# EAGLE schematic OpenEVSE_PLUS_v1 (EAGLE 6.0)
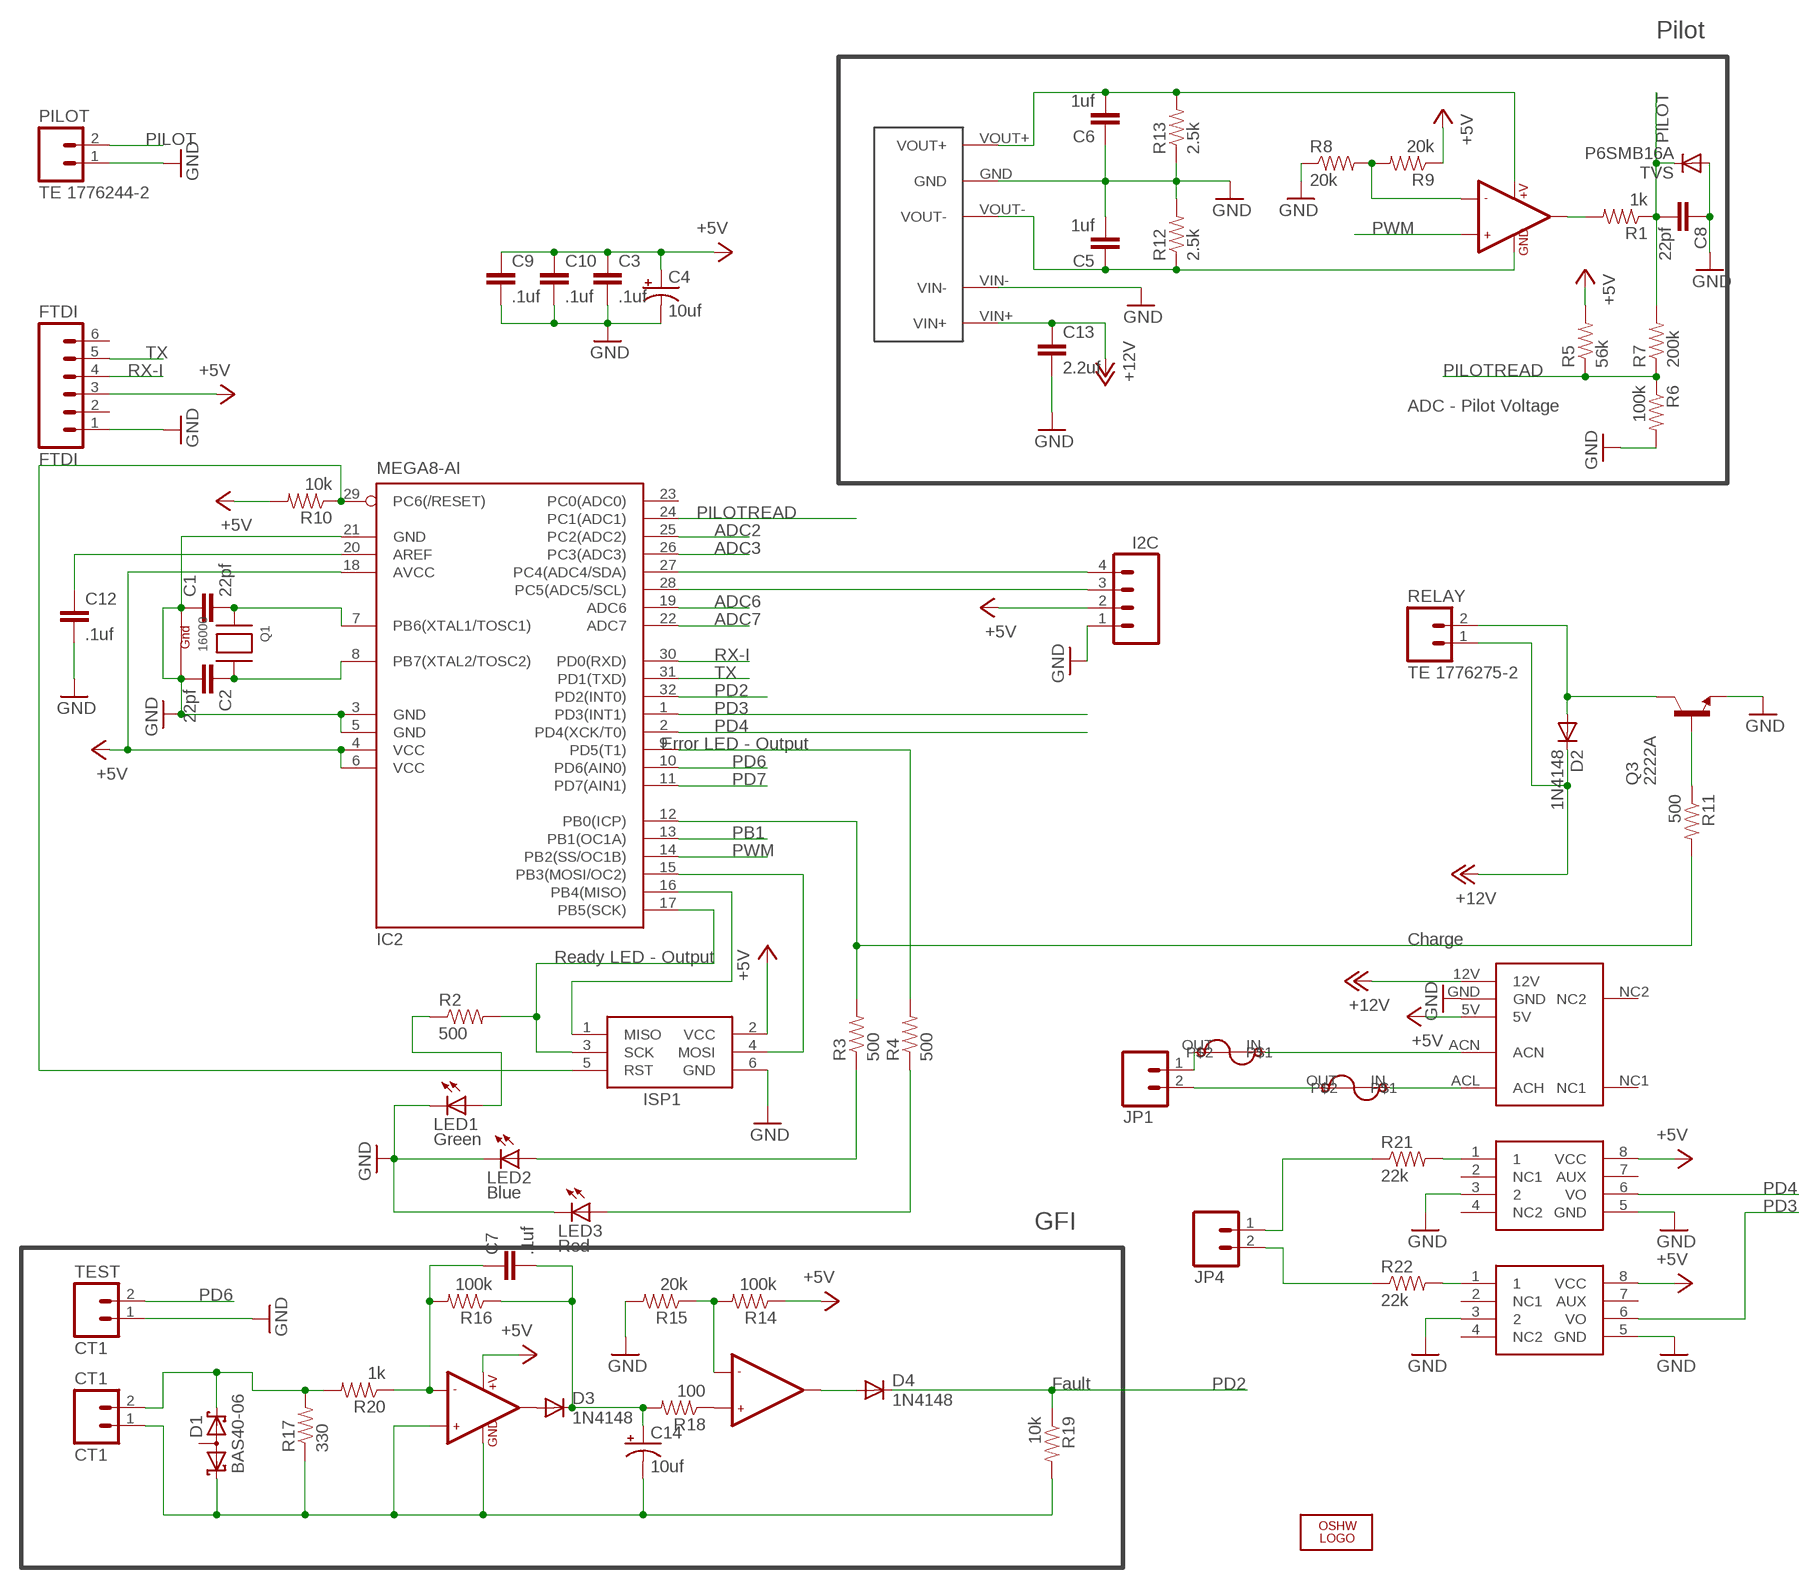
[diagram p0: schematic, sheet 1]

## Parts
C1  22pf  CAP0805  [0805]
C2  22pf  CAP0805  [0805]
C3  .1uf  CAP0805  [0805]
C4  10uf  CAP_POL1206  [EIA3216]
C5  1uf  CAP0805  [0805]
C6  1uf  CAP0805  [0805]
C7  .1uf  CAP0805  [0805]
C8  22pf  CAP0805  [0805]
C9  .1uf  CAP0805  [0805]
C10  .1uf  CAP0805  [0805]
C12  .1uf  CAP0805  [0805]
C13  2.2uf  CAP0805  [0805]
C14  10uf  CAP_POL1206  [EIA3216]
CT1  CT1  M02LOCK  [1X02_LOCK]
D1  BAS40-06  [SOT23]
D2  1N4148  DIODE-SOD123  [SOD123]
D3  1N4148  DIODE-SOD123  [SOD123]
D4  1N4148  DIODE-SOD123  [SOD123]
DCDC  D107E  DCDC_SIP  [DCDC_SIP]
FTDI  FTDI  M06LOCK  [1X06_LOCK]
I2C  M04LOCK  [1X04_LOCK]
IC1  MID400  [DIP08]
IC2  MEGA8-AI  [TQFP32-08]
IC3  LMV358  [SO08]
IC4  LMV358  [SO08]
IC5  MID400  [DIP08]
ISP1  AVRISP-6  [AVRISP]
JP1  M025MM  [SCREWTERMINAL-5MM-2]
JP4  M025MM  [SCREWTERMINAL-5MM-2]
LED1  Green  LED0603  [LED-0603]
LED2  Blue  LED0603  [LED-0603]
LED3  Red  LED0603  [LED-0603]
LOGO1  OSHW_LOGO_8MILX0150-NT  [OSHW_8X150_NOTEXT]
PILOT  TE 1776244-2  M025MM  [SCREWTERMINAL-5MM-2]
Q1  16000  XTAL-4-3225  [NX3225]
Q3  2222A  BCX70SMD  [SOT23]
R1  1k  RESISTOR0805-RES  [0805]
R2  500  RESISTOR0805-RES  [0805]
R3  500  RESISTOR0805-RES  [0805]
R4  500  RESISTOR0805-RES  [0805]
R5  56k  RESISTOR0805-RES  [0805]
R6  100k  RESISTOR0805-RES  [0805]
R7  200k  RESISTOR0805-RES  [0805]
R8  20k  RESISTOR0805-RES  [0805]
R9  20k  RESISTOR0805-RES  [0805]
R10  10k  RESISTOR0805-RES  [0805]
R11  500  RESISTOR0805-RES  [0805]
R12  2.5k  RESISTOR0805-RES  [0805]
R13  2.5k  RESISTOR0805-RES  [0805]
R14  100k  RESISTOR0805-RES  [0805]
R15  20k  RESISTOR0805-RES  [0805]
R16  100k  RESISTOR0805-RES  [0805]
R17  330  RESISTOR0805-RES  [0805]
R18  100  RESISTOR0805-RES  [0805]
R19  10k  RESISTOR0805-RES  [0805]
R20  1k  RESISTOR0805-RES  [0805]
R21  22k  RESISTORPTH-1/4W  [AXIAL-0.4]
R22  22k  RESISTORPTH-1/4W  [AXIAL-0.4]
RELAY  TE 1776275-2  M023.5MM_LOCK  [SCREWTERMINAL-3.5MM-2_LOCK]
TEST  CT1  M02LOCK  [1X02_LOCK]
TVS  P6SMB16A  DIODE-SMB  [SMB]
U$1  MPM-04E-1205  [MPM-04E-1205]
U$2  BEL1AFUSE  [BELFUSE1A]
U$5  BEL1AFUSE  [BELFUSE1A]

## Nets
12V: C6.2 DCDC.VOUT+ IC4.8(+V) R13.2
+5V: C3.1 C4.A(+) C9.1 C10.1 FTDI.3 I2C.2 IC1.8(VCC) IC2.4(VCC) IC2.6(VCC) IC2.18(AVCC) IC3.8(+V) IC5.8(VCC) ISP1.2(VCC) R5.2 R9.1 R10.2 R14.1 U$1.5V
+12V: C13.1 D2.C DCDC.VIN+ RELAY.1 U$1.12V
-12V: C5.1 DCDC.VOUT- IC4.4(GND) R12.1
ADC2: IC2.25(PC2(ADC2))
ADC3: IC2.26(PC3(ADC3))
ADC6: IC2.19(ADC6)
ADC7: IC2.22(ADC7)
GND: C1.1 C2.2 C3.2 C4.C(-) C5.2 C6.1 C8.1 C9.2 C10.2 C12.2 C13.2 DCDC.GND DCDC.VIN- FTDI.1 I2C.1 IC1.3 IC1.5(GND) IC2.3(GND) IC2.5(GND) IC2.21(GND) IC5.3 IC5.5(GND) ISP1.6(GND) LED1.C LED2.C LED3.C PILOT.1 Q1.1(G1) Q1.3(G2) Q3.2(E) R6.2 R8.1 R12.2 R13.1 R15.2 TEST.1 TVS.A U$1.GND
N$1: LED3.A R4.1
N$2: Q3.1(B) R11.1
N$3: C14.C(-) CT1.1 D1.1(K1) IC3.3(+IN1) IC3.4(GND) R17.1 R19.2
N$4: C1.2 IC2.7(PB6(XTAL1/TOSC1)) Q1.2(X1)
N$5: C2.1 IC2.8(PB7(XTAL2/TOSC2)) Q1.4(X2)
N$6: LED2.A R3.1
N$7: U$1.ACL(ACH) U$2.IN
N$8: C7.1 IC3.2(-IN1) R16.2 R20.1
N$9: U$1.ACN U$5.IN
N$10: IC4.2(-IN1) R8.2 R9.2
N$11: IC4.1(OUT1) R1.2
N$12: JP1.2 U$2.OUT
N$13: JP1.1 U$5.OUT
N$14: IC2.15(PB3(MOSI/OC2)) ISP1.4(MOSI)
N$15: IC2.17(PB5(SCK)) ISP1.3(SCK) R2.2
N$16: IC2.16(PB4(MISO)) ISP1.1(MISO)
N$17: LED1.A R2.1
N$18: IC1.1 R21.P$2
N$19: IC5.1 R22.P$2
N$20: CT1.2 D1.2(K2) R17.2 R20.2
N$21: D3.A IC3.1(OUT1)
N$23: C7.2 C14.A(+) D3.C R16.1 R18.2
N$24: IC3.6(-IN2) R14.2 R15.1
N$25: D4.A IC3.7(OUT2)
N$26: IC3.5(+IN2) R18.1
N$28: JP4.1 R21.P$1
N$29: JP4.2 R22.P$1
N$34: IC2.12(PB0(ICP)) R3.2 R11.2
N$36: IC2.9(PD5(T1)) R4.2
N$39: I2C.4 IC2.27(PC4(ADC4/SDA))
N$40: I2C.3 IC2.28(PC5(ADC5/SCL))
N$44: C12.1 IC2.20(AREF)
PB1: IC2.13(PB1(OC1A))
PD2: D4.C IC2.32(PD2(INT0)) R19.1
PD3: IC2.1(PD3(INT1)) IC5.6(VO)
PD4: IC1.6(VO) IC2.2(PD4(XCK/T0))
PD6: IC2.10(PD6(AIN0)) TEST.2
PD7: IC2.11(PD7(AIN1))
PILOT: C8.2 PILOT.2 R1.1 R7.2 TVS.C
PILOTREAD: IC2.24(PC1(ADC1)) R5.1 R6.1 R7.1
PWM: IC2.14(PB2(SS/OC1B)) IC4.3(+IN1)
RELAY: D2.A Q3.3(C) RELAY.2
RST: IC2.29(PC6(/RESET)) ISP1.5(RST) R10.1
RX-I: FTDI.4 IC2.30(PD0(RXD))
TX: FTDI.5 IC2.31(PD1(TXD))
Unconnected: D1.3(AA) FTDI.2 FTDI.6 IC1.2(NC1) IC1.4(NC2) IC1.7(AUX) IC2.23(PC0(ADC0)) IC4.5(+IN2) IC4.6(-IN2) IC4.7(OUT2) IC5.2(NC1) IC5.4(NC2) IC5.7(AUX) U$1.NC1 U$1.NC2

## Notes on the sheet
- Pilot
- ADC - Pilot Voltage
- Error LED - Output
- Charge
- Ready LED - Output
- GFI
- Fault

## Library data of the parts
C1-C3 C5-C10 C12 C13 = SparkFun:CAP: Capacitor Standard 0603 ceramic capacitor, and 0.1" leaded capacitor.
C4 C14 = SparkFun:CAP_POL: Capacitor Polarized These are standard SMD and PTH capacitors. Normally 10uF, 47uF, and 100uF in electrolytic and tantalum varieties. Always verify the external diameter of the through hole cap, it varies with capacity, voltage, and manufacturer. The EIA devices should be standard.
CT1 JP1 JP4 PILOT RELAY TEST = SparkFun:M02: Header 2 Standard 2-pin 0.1" header. Use with straight break away headers (SKU : PRT-00116), right angle break away headers (PRT-00553), swiss pins (PRT-00743), machine pins (PRT-00117), and female headers (PRT-00115). Molex polarized connector foot print use with SKU : PRT-08233 with associated crimp pins and housings.
D1 = diode:BAS40-06: Silicon Schottky Diodes General-purpose diode for high-speed switching
D2-D4 TVS = diode:DIODE-: DIODE
DCDC = Qxd:DCDC_SIP
FTDI = SparkFun:M06: Header 6 Standard 6-pin 0.1" header. Use with straight break away headers (SKU : PRT-00116), right angle break away headers (PRT-00553), swiss pins (PRT-00743), machine pins (PRT-00117), and female headers (PRT-00115). Molex polarized connector foot print use with SKU : PRT-08094 with associated crimp pins and housings. NOTES ON THE VARIANTS LOCK and LOCK_LONGPADS... This footprint was designed to help hold the alignment of a through-hole component (i.e. 6-pin header) while soldering it into place. You may notice that each hole has been shifted either up or down by 0.005 of an inch from it's more standard position (which is a perfectly straight line). This slight alteration caused the pins (the squares in the middle) to touch the edges of the holes. Because they are alternating, it causes a "brace" to hold the component in place. 0.005 has proven to be the perfect amount of "off-center" position when using our standard breakaway headers. Although looks a little odd when you look at the bare footprint, once you have a header in there, the alteration is very hard to notice. Also, if you push a header all the way into place, it is covered up entirely on the bottom side. This idea of altering the position of holes to aid alignment will be further integrated into the Sparkfun Library for other footprints. It can help hold any component with 3 or more connection pins.
I2C = SparkFun:M04: Header 4 Standard 4-pin 0.1" header. Use with straight break away headers (SKU : PRT-00116), right angle break away headers (PRT-00553), swiss pins (PRT-00743), machine pins (PRT-00117), and female headers (PRT-00115). Molex polarized connector foot print use with SKU : PRT-08231 with associated crimp pins and housings.
IC1 IC5 = SparkFun:MID400
IC2 = atmel:MEGA8: MICROCONTROLLER 8 Kbytes FLASH, 1 kbytes SRAM, 512 bytes EEPROM, USART, 6-channel 10 bit ADC, 2-channel 8 bit ADC Pin compatible with Atmega48, ATMega88, ATMega168 Source: avr.lbr; MPN: ATMEGA8-16AU; OC_FARNELL: 9171371; OC_NEWARK: 73M8863
IC3 IC4 = SparkFun:LMV358
ISP1 = adafruit:AVRISP: AVR ISP HEADER Standard 6 pin header for AVR programming
LED1-LED3 = SparkFun:LED: LEDs Standard schematic elements and footprints for 5mm, 3mm, 1206, and 0603 sized LEDs. 5mm - Spark Fun Electronics SKU : COM-00529 (and others)
LOGO1 = ohw-logo:OSHW_LOGO_8MIL
Q1 = adafruit:XTAL-4: Classic 4-pin 3.2 x 2.5mm crystal
Q3 = transistor-npn:BCX70*: NPN Transistor
R1-R22 = SparkFun:RESISTOR: Resistor Basic schematic elements and footprints for 0603, 1206, and PTH resistors.
U$1 = Qxd:MPM-04E-1205
U$2 U$5 = Qxd:BEL1AFUSE